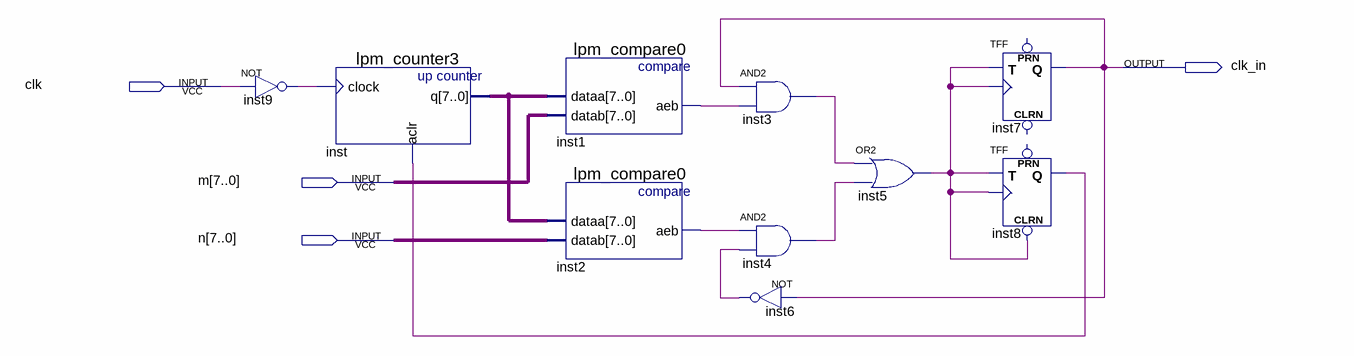
[diagram p0: schematic sheet]
// Quartus schematic AltBlock.bdf as structural Verilog: 10 symbols, 4 pins
module AltBlock (
  input  clk,
  input  [7:0] m,
  input  [7:0] n,
  output clk_in
);

  wire inst1_aeb, inst2_aeb, inst3_out, inst4_out, inst5_out, inst6_out, inst8_q, inst9_out;
  wire [7:0] inst_q;

  not inst9 (inst9_out, clk);
  lpm_counter3 inst (.clock(inst9_out), .aclr(inst8_q), .q(inst_q));
  lpm_compare0 inst1 (.dataa(inst_q), .datab(m), .aeb(inst1_aeb));
  lpm_compare0 inst2 (.dataa(inst_q), .datab(n), .aeb(inst2_aeb));
  and inst3 (inst3_out, clk_in, inst1_aeb);
  and inst4 (inst4_out, inst2_aeb, inst6_out);
  not inst6 (inst6_out, clk_in);
  or inst5 (inst5_out, inst3_out, inst4_out);
  TFF inst7 (.T(inst5_out), .CLK(inst5_out), .Q(clk_in));  // open: PRN, CLRN
  TFF inst8 (.CLRN(inst5_out), .T(inst5_out), .CLK(inst5_out), .Q(inst8_q));  // open: PRN
endmodule
